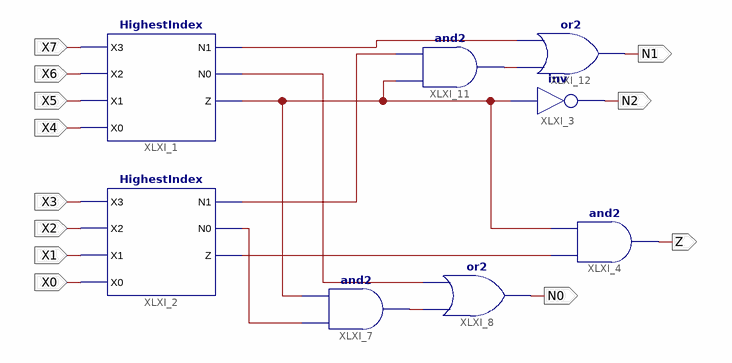
[diagram p0: schematic sheet 1]
// Xilinx ISE schematic Priority_Encoder.sch (spartan3a) as structural Verilog: 8 symbols, 12 ports
module Priority_Encoder (
  input  X7,
  input  X6,
  input  X5,
  input  X4,
  input  X3,
  input  X2,
  input  X1,
  input  X0,
  output N2,
  output Z,
  output N0,
  output N1
);

  wire XLXN_11, XLXN_12, XLXN_16, XLXN_18, XLXN_27, XLXN_28, XLXN_32, XLXN_33;

  HighestIndex XLXI_1 (.N0(XLXN_27), .N1(XLXN_33), .X0(X4), .X1(X5), .X2(X6), .X3(X7), .Z(XLXN_12));
  HighestIndex XLXI_2 (.N0(XLXN_16), .N1(XLXN_28), .X0(X0), .X1(X1), .X2(X2), .X3(X3), .Z(XLXN_11));
  not XLXI_3 (N2, XLXN_12);
  and XLXI_4 (Z, XLXN_11, XLXN_12);
  and XLXI_7 (XLXN_18, XLXN_16, XLXN_12);
  or XLXI_8 (N0, XLXN_18, XLXN_27);
  and XLXI_11 (XLXN_32, XLXN_12, XLXN_28);
  or XLXI_12 (N1, XLXN_32, XLXN_33);
endmodule
